# Altium schematic sheet Detection.SchDoc: LC Detection
size A3; Project: STM32L073Z-EVAL; Date: Not used; ApprovedBy: Not used; CheckedBy: Not used; Author: Not used; CompanyName: STMicroelectronics; DrawnBy: Not used; Engineer: Not used; Organization: Not used; Address1: Not used; Address2: Not used; Address3: Not used; Address4: Not used; DocumentNumber: 9; Revision: Not used; SheetNumber: 10; SheetTotal: 13; CurrentTime: Not used; CurrentDate: Not used; Time: Not used; DocumentFullPathAndName: Not used; DocumentName: Not used; ModifiedDate: Not used; ImagePath: Not used; ProjectName: Not used; Application_BuildNumber: Not used
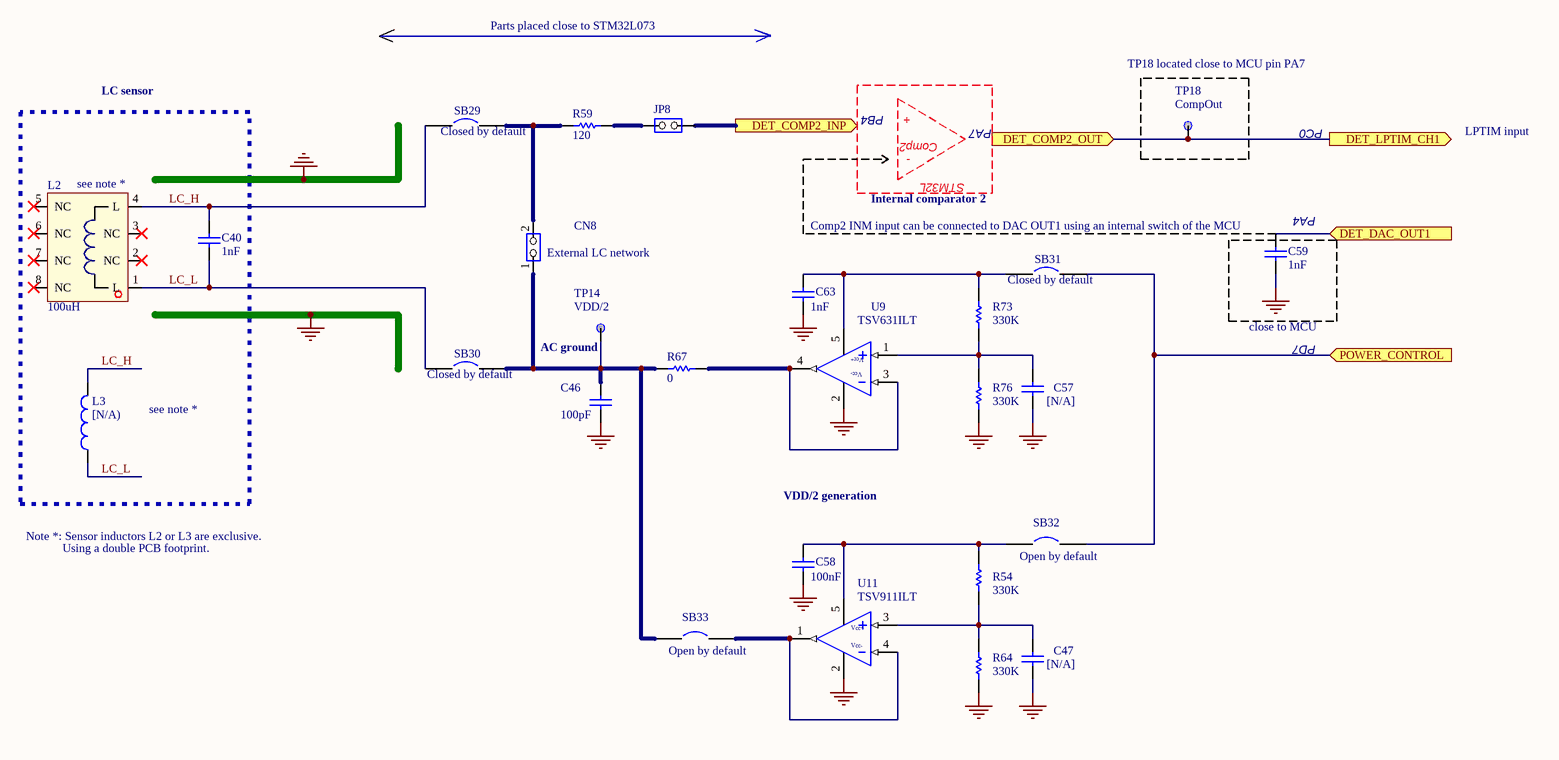
[diagram p0: Detection.SchDoc]

## Parts
C40  1nF  [0603C]
C46  100pF  [0402C]
C47  [N/A]  [0603C]
C57  [N/A]  [0603C]
C58  100nF  [0402C]
C59  1nF  [0603C]
C63  1nF  [0402C]
CN8  Silkscreen: External LC network  [SIP2]  (hidden comment: Header 2X1)
JP8  (no value)  [SIP2]
L2  100uH  [ER95]
L3  [N/A)  [LSM2_4R4X3R2_H3]
R54  330K  [0402R]
R59  120  [0603R]
R64  330K  [0402R]
R67  0  [0603R]
R73  330K  [0402R]
R76  330K  [0402R]
SB29  Closed by default  [SB_0603]
SB30  Closed by default  [SB_0603]
SB31  Closed by default  [SB_0603]
SB32  Open by default  [SB_0603]
SB33  Open by default  [SB_0603]
TP14  Silkscreen: VDD/2  [TP]  (hidden comment: TP)
TP18  Silkscreen: CompOut  [TP]  (hidden comment: TP)
U9  TSV631ILT  [SOT-23-5L]
U11  TSV911ILT  [SOT-23-5L]

## Ports
DET_COMP2_INP (out), DET_COMP2_OUT (in), DET_DAC_OUT1 (in), DET_LPTIM_CH1 (out), POWER_CONTROL (in)

## Nets
GND: C46.1 C47.2 C57.2 C58.2 C59.2 C63.2 R64.2 R76.2 U9.2(Vcc-) U11.2(Vcc-)
DET_COMP2_INP: JP8.2(NO) ; port DET_COMP2_INP
DET_COMP2_OUT: TP18.1 ; port DET_COMP2_OUT, port DET_LPTIM_CH1
DET_DAC_OUT1: C59.1 ; port DET_DAC_OUT1
LC_H: C40.2 L2.4(L) L3.2 SB29.1
LC_L: C40.1 L2.1(L) L3.1 SB30.1
POWER_CONTROL: SB31.2 SB32.2 ; port POWER_CONTROL
NetC46_2: C46.2 CN8.1(COMMON) R67.1 SB30.2 SB33.1 TP14.1
NetC47_1: C47.1 R54.2 R64.1 U11.3(Vp)
NetC57_1: C57.1 R73.2 R76.1 U9.1(Vp)
NetC58_1: C58.1 R54.1 SB32.1 U11.5(Vcc+)
NetC63_1: C63.1 R73.1 SB31.1 U9.5(Vcc+)
NetCN8_2: CN8.2(NO) R59.1 SB29.2
NetJP8_1: JP8.1(COMMON) R59.2
NetR67_2: R67.2 U9.3(Vm) U9.4(OUT)
NetSB33_2: SB33.2 U11.1(OUT) U11.4(Vm)

Not connected (* = marked no-connect by the designer): L2 2(NC)* 3(NC)* 5(NC)* 6(NC)* 7(NC)* 8(NC)*

## Notes on the sheet
- Parts placed close to STM32L073
- LC sensor
- PB4
- +
- TP18 located close to MCU pin PA7
- -
- Comp2
- STM32L
- PA7
- PC0
- LPTIM input
- (near L2) see note *
- (near C59) Comp2 INM input can be connected to DAC OUT1 using an internal switch of the MCU
- Internal comparator 2
- (near C59) PA4
- (near TP14) AC ground
- close to MCU
- PD7
- see note *
- VDD/2 generation
- Note *: Sensor inductors L2 or L3 are exclusive.
- Using a double PCB footprint.
- Title:
- Project:
- Size:
- Revision:
- Variant:
- A3
- Date:
- Reference:
- Sheet:
- of

## Library data of the parts
C40 C46 C59 C63 = Capacitor_ST: Capacitor; Value: 100nF; Ordered by: Subcon; Revision: July-2002: Re-released for DXP Platform.; ECCN_US/EU: n/a
C47 C57 = Capacitor_ST: Capacitor; Value: 100nF; Ordered by: Subcon; Fitted: NO; Revision: July-2002: Re-released for DXP Platform.; ECCN_US/EU: n/a
C58 = Capacitor_ST: Capacitor; Ordered by: Subcon; Revision: July-2002: Re-released for DXP Platform.; Value: 100nF; ECCN_US/EU: n/a
CN8 = JP2: Manuf_1: LWCONN; Manuf_Part_1: 313102S111116; Ordered by: Subcon; ECCN_US/EU: n/a
JP8 = JP2: Ordered by: Subcon; Silkscreen: Comp_INP; Assembly: closed; ECCN_US/EU: n/a
L2 = Wurth_ER9.5: Wurth E core inductor 750315110; Manuf_1: Wurth Elektronik; Ordered by: Subcon; Manuf_Part_1: 750315110; ECCN_US/EU: n/a
L3 = Inductor: Cyntec/Delta  Inductor SIE4734-101; Manuf_1: DELTA; Value: 100uH; Ordered by: ST; Fitted: NO; Published: 8-Jun-2000; Revision: July-2002: Re-released for DXP Platform.; Publisher: Altium Limited; ECCN_US/EU: n/a; Manuf_Part_1: SIE4734-101
R54 R59 R64 R67 R73 R76 = Res1: Resistor; Value: 1K; Ordered by: Subcon; Published: 8-Jun-2000; Revision: July-2002: Re-released for DXP Platform.; Publisher: Altium Limited; ECCN_US/EU: n/a
SB29-SB31 = Circuit Breaker: Ordered by: Subcon; Comments: Solder bridge; Published: 24-Mar-1999; Revision: July-2002: Re-released for DXP Platform.; Publisher: Altium Limited; ECCN_US/EU: n/a
SB32 SB33 = Circuit Breaker: Ordered by: Subcon; Comments: Solder bridge; Fitted: NO; Published: 24-Mar-1999; Revision: July-2002: Re-released for DXP Platform.; Publisher: Altium Limited; ECCN_US/EU: n/a
TP14 TP18 = TP: Ordered by: Subcon; Fitted: NO; ECCN_US/EU: n/a
U9 = TSV631ILT: single OpAmp 60 µA, 880 kHz, 5 V CMOS; Manuf_1: ST; Order: MAX9938FEUK+; Ref St: 9177446; ECCN_US/EU: EAR99/NEC; Manuf_Part_1: TSV631ILT; Ordered by: ST
U11 = TSV911ILT: single 8MHz  operational amplifiers; Manuf_1: ST; Order: MAX9938FEUK+; Ref St: 9177436; ECCN_US/EU: EAR99/NEC; Manuf_Part_1: TSV911ILT; Ordered by: ST